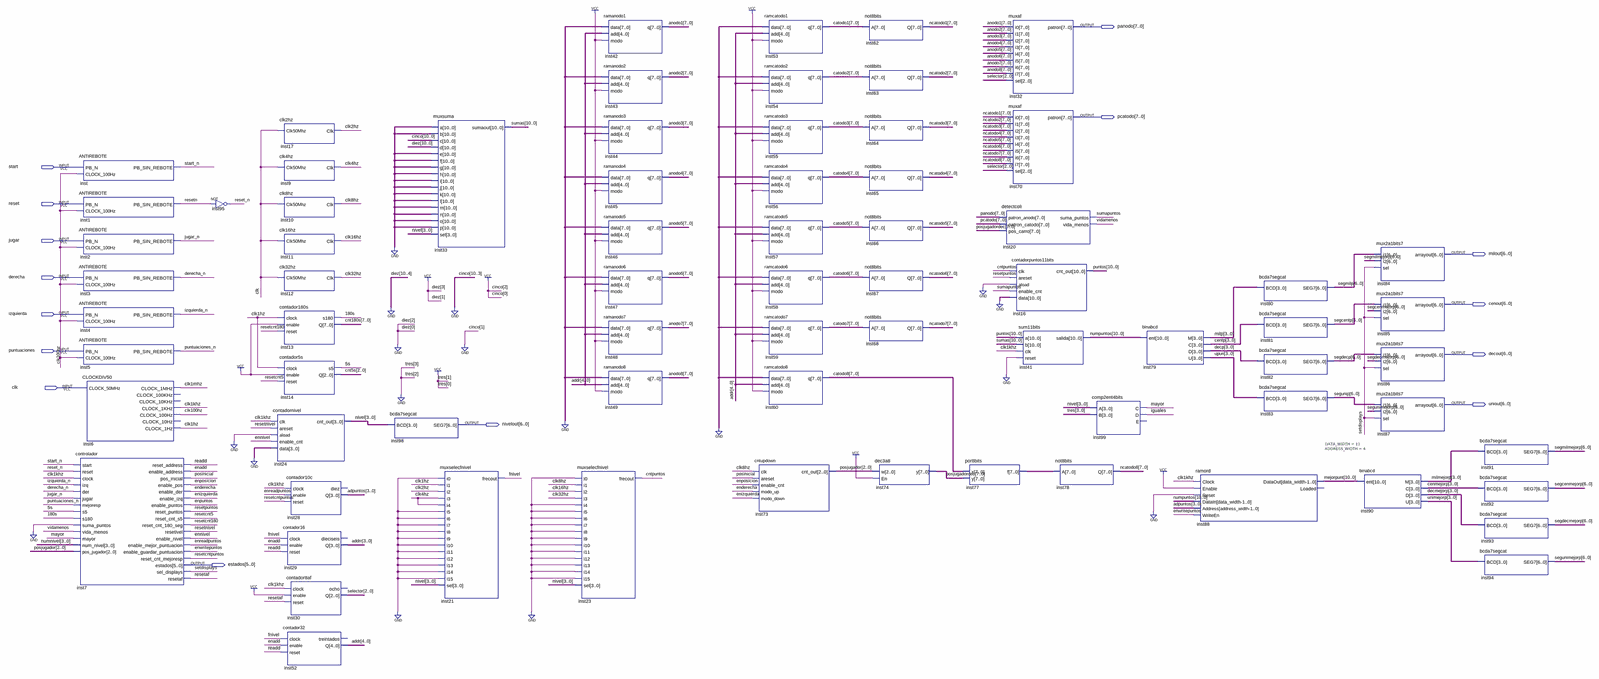
[diagram p0: schematic sheet, whole]
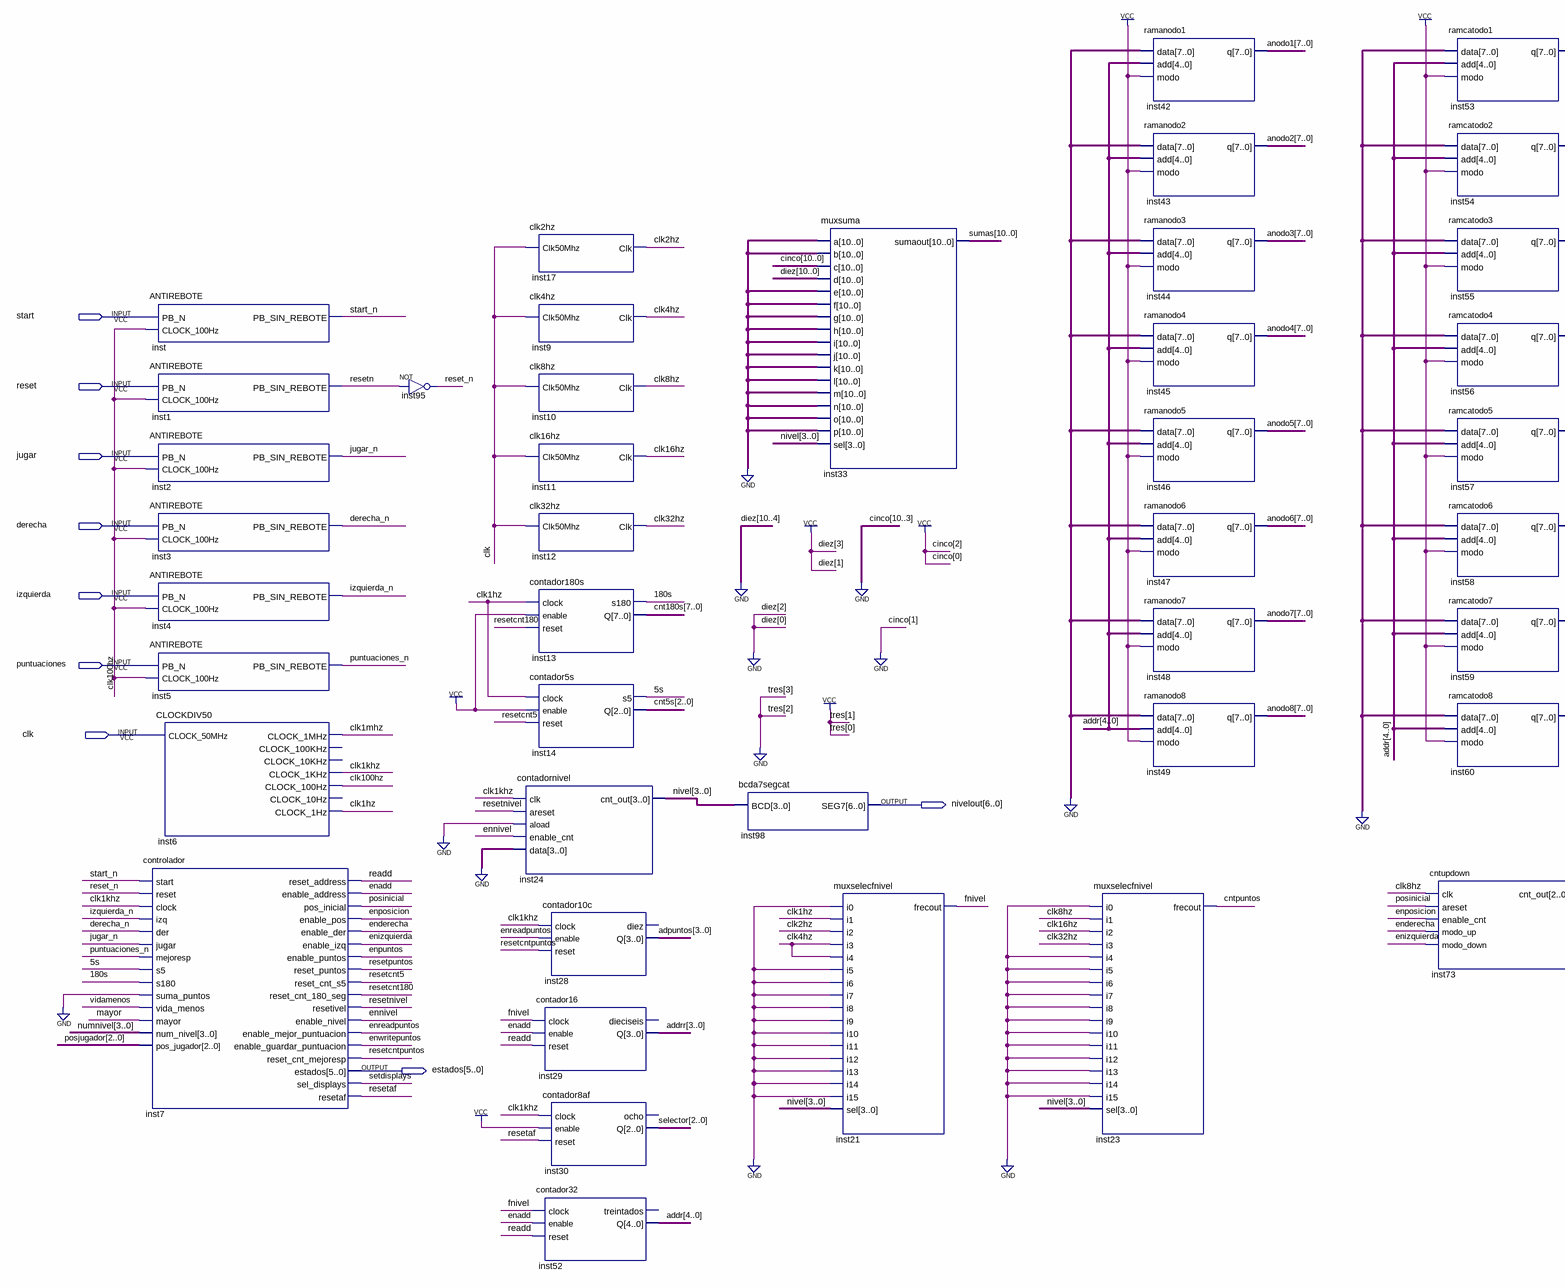
[diagram p1: schematic sheet, left part]
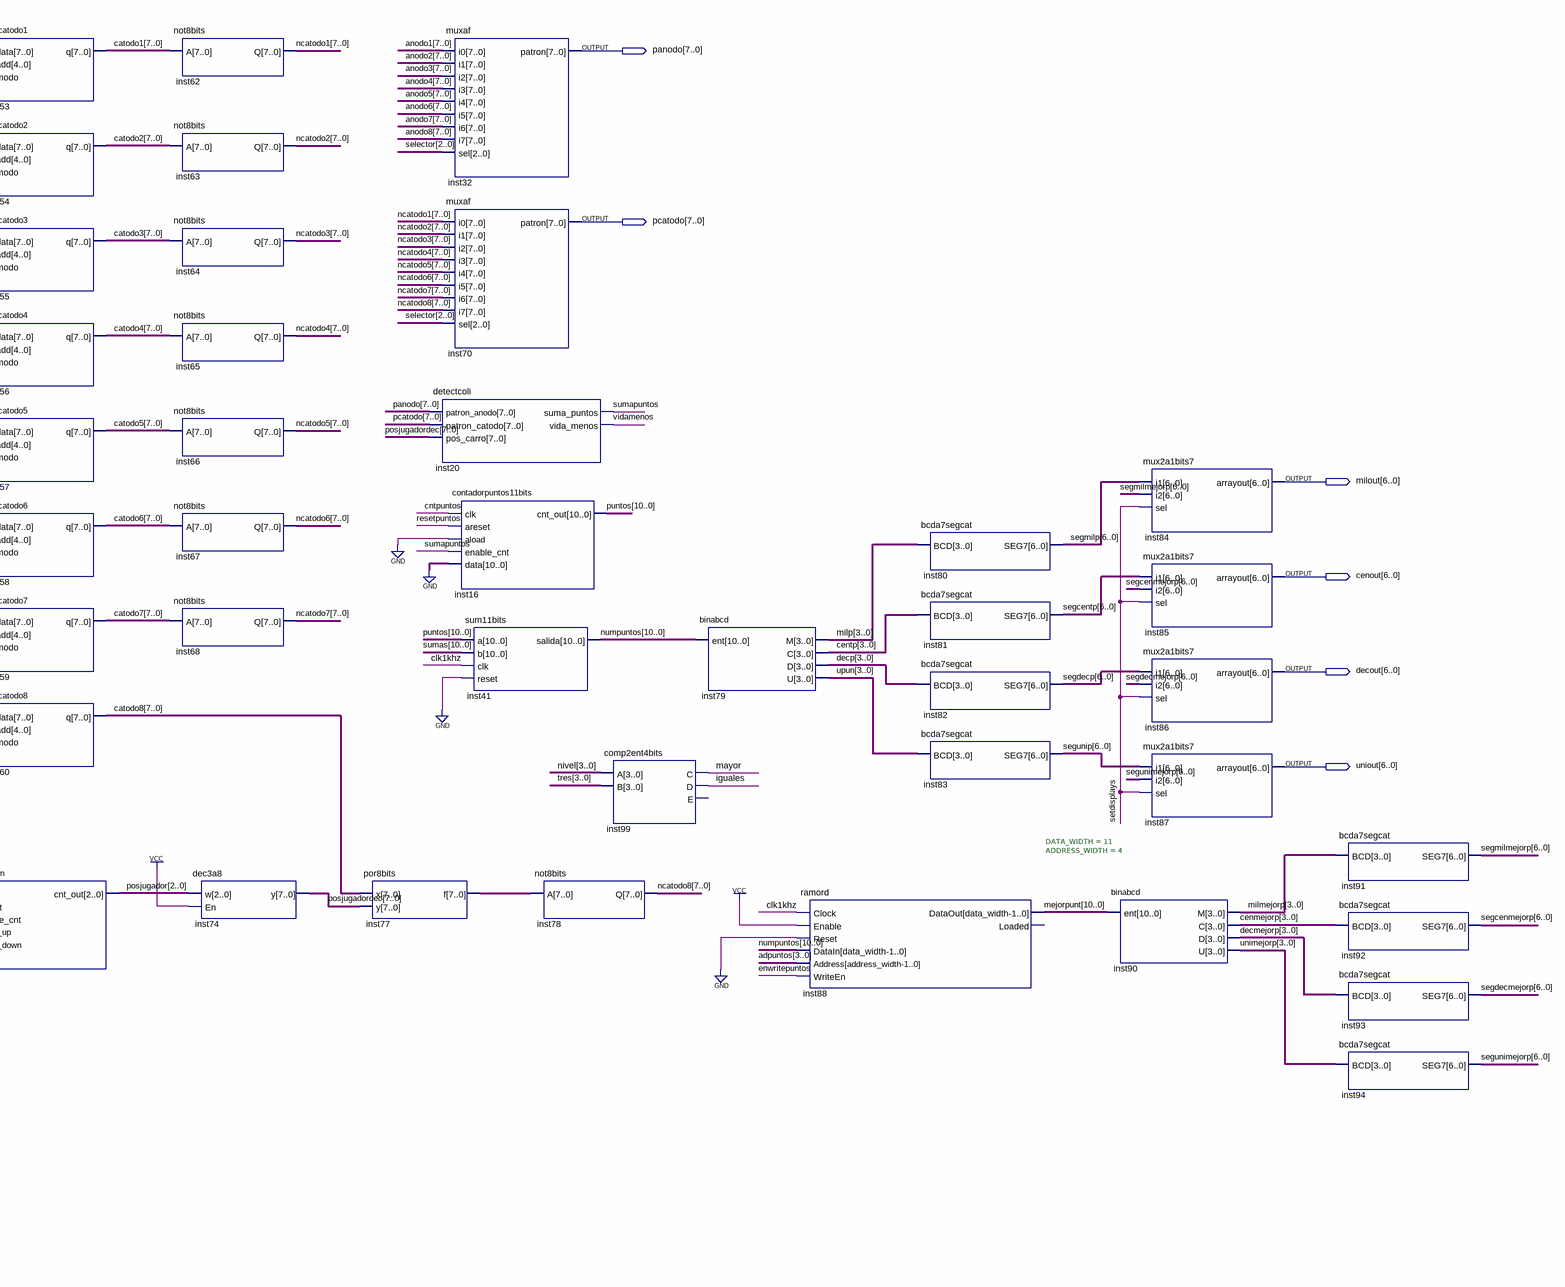
[diagram p2: schematic sheet, right part]
// Quartus schematic Proyecto.bdf as structural Verilog: 73 symbols, 15 pins
module Proyecto (
  input  start,
  input  reset,
  input  jugar,
  input  derecha,
  input  izquierda,
  input  puntuaciones,
  input  clk,
  output [7:0] panodo,
  output [7:0] pcatodo,
  output [6:0] milout,
  output [6:0] cenout,
  output [6:0] decout,
  output [6:0] uniout,
  output [6:0] nivelout,
  output [5:0] estados
);

  wire \5s , \180s , clk1hz, clk1khz, clk1mhz, clk2hz, clk4hz, clk8hz, clk16hz, clk32hz, clk100hz, cntpuntos,
       derecha_n, enadd, enderecha, enizquierda, ennivel, enposicion, enpuntos, enreadpuntos, enwritepuntos,
       fnivel, iguales, izquierda_n, jugar_n, mayor, posinicial, puntuaciones_n, readd, reset_n, resetaf,
       resetcnt5, resetcnt180, resetcntpuntos, resetn, resetnivel, resetpuntos, setdisplays, start_n,
       sumapuntos, vidamenos;
  wire [2:0] cnt5s, posjugador, selector;
  wire [3:0] addrr, adpuntos, cenmejorp, centp, decmejorp, decp, milmejorp, milp, nivel, numnivel, unimejorp,
       upun;
  wire [4:0] addr;
  wire [6:0] segcenmejorp, segcentp, segdecmejorp, segdecp, segmilmejorp, segmilp, segunimejorp, segunip;
  wire [7:0] anodo1, anodo2, anodo3, anodo4, anodo5, anodo6, anodo7, anodo8, catodo1, catodo2, catodo3,
       catodo4, catodo5, catodo6, catodo7, catodo8, cnt180s, inst77_f, ncatodo1, ncatodo2, ncatodo3,
       ncatodo4, ncatodo5, ncatodo6, ncatodo7, ncatodo8, posjugadordec;
  wire [10:0] mejorpunt, numpuntos, puntos, sumas;

  controlador inst7 (
    .start(start_n), .reset(reset_n), .clock(clk1khz), .izq(izquierda_n), .der(derecha_n), .jugar(jugar_n),
    .mejoresp(puntuaciones_n), .s5(\5s ), .s180(\180s ), .suma_puntos(1'b0), .vida_menos(vidamenos),
    .mayor(mayor), .num_nivel(numnivel), .pos_jugador(posjugador), .reset_address(readd),
    .enable_address(enadd), .pos_inicial(posinicial), .enable_pos(enposicion), .enable_der(enderecha),
    .enable_izq(enizquierda), .enable_puntos(enpuntos), .reset_puntos(resetpuntos), .reset_cnt_s5(resetcnt5),
    .reset_cnt_180_seg(resetcnt180), .resetivel(resetnivel), .enable_nivel(ennivel),
    .enable_mejor_puntuacion(enreadpuntos), .enable_guardar_puntuacion(enwritepuntos),
    .reset_cnt_mejoresp(resetcntpuntos), .estados(estados), .sel_displays(setdisplays), .resetaf(resetaf));
  ANTIREBOTE inst (.PB_N(start), .CLOCK_100Hz(clk100hz), .PB_SIN_REBOTE(start_n));
  ANTIREBOTE inst1 (.PB_N(reset), .CLOCK_100Hz(clk100hz), .PB_SIN_REBOTE(resetn));
  ANTIREBOTE inst2 (.PB_N(jugar), .CLOCK_100Hz(clk100hz), .PB_SIN_REBOTE(jugar_n));
  ANTIREBOTE inst3 (.PB_N(derecha), .CLOCK_100Hz(clk100hz), .PB_SIN_REBOTE(derecha_n));
  ANTIREBOTE inst4 (.PB_N(izquierda), .CLOCK_100Hz(clk100hz), .PB_SIN_REBOTE(izquierda_n));
  ANTIREBOTE inst5 (.PB_N(puntuaciones), .CLOCK_100Hz(clk100hz), .PB_SIN_REBOTE(puntuaciones_n));
  CLOCKDIV50 inst6 (
    .CLOCK_50MHz(clk), .CLOCK_1MHz(clk1mhz), .CLOCK_1KHz(clk1khz), .CLOCK_100Hz(clk100hz), .CLOCK_1Hz(clk1hz));  // open: CLOCK_100KHz, CLOCK_10KHz, CLOCK_10Hz
  not inst95 (reset_n, resetn);
  clk2hz inst17 (.Clk50Mhz(clk), .Clk(clk2hz));
  clk4hz inst9 (.Clk50Mhz(clk), .Clk(clk4hz));
  clk8hz inst10 (.Clk50Mhz(clk), .Clk(clk8hz));
  clk16hz inst11 (.Clk50Mhz(clk), .Clk(clk16hz));
  clk32hz inst12 (.Clk50Mhz(clk), .Clk(clk32hz));
  contador180s inst13 (.clock(clk1hz), .enable(1'b1), .reset(resetcnt180), .s180(\180s ), .Q(cnt180s));
  contador5s inst14 (.clock(clk1hz), .enable(1'b1), .reset(resetcnt5), .s5(\5s ), .Q(cnt5s));
  contadornivel inst24 (
    .clk(clk1khz), .areset(resetnivel), .aload(1'b0), .enable_cnt(ennivel), .data(4'b0000), .cnt_out(nivel));
  contador10c inst28 (.clock(clk1khz), .enable(enreadpuntos), .reset(resetcntpuntos), .Q(adpuntos));  // open: diez
  contador16 inst29 (.clock(fnivel), .enable(enadd), .reset(readd), .Q(addrr));  // open: dieciseis
  contador8af inst30 (.clock(clk1khz), .enable(1'b1), .reset(resetaf), .Q(selector));  // open: ocho
  contador32 inst52 (.clock(fnivel), .enable(enadd), .reset(readd), .Q(addr));  // open: treintados
  bcda7segcat inst98 (.BCD(nivel), .SEG7(nivelout));
  muxsuma inst33 (
    .a({11{1'b0}}), .b({11{1'b0}}), .c(11'b00000000101), .d(11'b00000001010), .e({11{1'b0}}), .f({11{1'b0}}),
    .g({11{1'b0}}), .h({11{1'b0}}), .i({11{1'b0}}), .j({11{1'b0}}), .k({11{1'b0}}), .l({11{1'b0}}),
    .m({11{1'b0}}), .n({11{1'b0}}), .o({11{1'b0}}), .p({11{1'b0}}), .sel(nivel), .sumaout(sumas));
  muxselecfnivel inst21 (
    .i0(1'b0), .i1(clk1hz), .i2(clk2hz), .i3(clk4hz), .i4(clk4hz), .i5(1'b0), .i6(1'b0), .i7(1'b0),
    .i8(1'b0), .i9(1'b0), .i10(1'b0), .i11(1'b0), .i12(1'b0), .i13(1'b0), .i14(1'b0), .i15(1'b0),
    .sel(nivel), .frecout(fnivel));
  muxselecfnivel inst23 (
    .i0(1'b0), .i1(clk8hz), .i2(clk16hz), .i3(clk32hz), .i4(1'b0), .i5(1'b0), .i6(1'b0), .i7(1'b0),
    .i8(1'b0), .i9(1'b0), .i10(1'b0), .i11(1'b0), .i12(1'b0), .i13(1'b0), .i14(1'b0), .i15(1'b0),
    .sel(nivel), .frecout(cntpuntos));
  ramanodo1 inst42 (.data({8{1'b0}}), .add(addr), .modo(1'b1), .q(anodo1));
  ramanodo2 inst43 (.data({8{1'b0}}), .add(addr), .modo(1'b1), .q(anodo2));
  ramanodo3 inst44 (.data({8{1'b0}}), .add(addr), .modo(1'b1), .q(anodo3));
  ramanodo4 inst45 (.data({8{1'b0}}), .add(addr), .modo(1'b1), .q(anodo4));
  ramanodo5 inst46 (.data({8{1'b0}}), .add(addr), .modo(1'b1), .q(anodo5));
  ramanodo6 inst47 (.data({8{1'b0}}), .add(addr), .modo(1'b1), .q(anodo6));
  ramanodo7 inst48 (.data({8{1'b0}}), .add(addr), .modo(1'b1), .q(anodo7));
  ramanodo8 inst49 (.data({8{1'b0}}), .add(addr), .modo(1'b1), .q(anodo8));
  ramcatodo1 inst53 (.data({8{1'b0}}), .add(addr), .modo(1'b1), .q(catodo1));
  ramcatodo2 inst54 (.data({8{1'b0}}), .add(addr), .modo(1'b1), .q(catodo2));
  ramcatodo3 inst55 (.data({8{1'b0}}), .add(addr), .modo(1'b1), .q(catodo3));
  ramcatodo4 inst56 (.data({8{1'b0}}), .add(addr), .modo(1'b1), .q(catodo4));
  ramcatodo5 inst57 (.data({8{1'b0}}), .add(addr), .modo(1'b1), .q(catodo5));
  ramcatodo6 inst58 (.data({8{1'b0}}), .add(addr), .modo(1'b1), .q(catodo6));
  ramcatodo7 inst59 (.data({8{1'b0}}), .add(addr), .modo(1'b1), .q(catodo7));
  ramcatodo8 inst60 (.data({8{1'b0}}), .add(addr), .modo(1'b1), .q(catodo8));
  cntupdown inst73 (
    .clk(clk8hz), .areset(posinicial), .enable_cnt(enposicion), .modo_up(enderecha), .modo_down(enizquierda),
    .cnt_out(posjugador));
  not8bits inst62 (.A(catodo1), .Q(ncatodo1));
  not8bits inst63 (.A(catodo2), .Q(ncatodo2));
  not8bits inst64 (.A(catodo3), .Q(ncatodo3));
  not8bits inst65 (.A(catodo4), .Q(ncatodo4));
  not8bits inst66 (.A(catodo5), .Q(ncatodo5));
  not8bits inst67 (.A(catodo6), .Q(ncatodo6));
  not8bits inst68 (.A(catodo7), .Q(ncatodo7));
  dec3a8 inst74 (.w(posjugador), .En(1'b1), .y(posjugadordec));
  por8bits inst77 (.x(catodo8), .y(posjugadordec), .f(inst77_f));
  muxaf inst32 (
    .i0(anodo1), .i1(anodo2), .i2(anodo3), .i3(anodo4), .i4(anodo5), .i5(anodo6), .i6(anodo7), .i7(anodo8),
    .sel(selector), .patron(panodo));
  muxaf inst70 (
    .i0(ncatodo1), .i1(ncatodo2), .i2(ncatodo3), .i3(ncatodo4), .i4(ncatodo5), .i5(ncatodo6), .i6(ncatodo7),
    .i7(ncatodo8), .sel(selector), .patron(pcatodo));
  detectcoli inst20 (
    .patron_anodo(panodo), .patron_catodo(pcatodo), .pos_carro(posjugadordec), .suma_puntos(sumapuntos),
    .vida_menos(vidamenos));
  contadorpuntos11bits inst16 (
    .clk(cntpuntos), .areset(resetpuntos), .aload(1'b0), .enable_cnt(sumapuntos), .data({11{1'b0}}),
    .cnt_out(puntos));
  sum11bits inst41 (.a(puntos), .b(sumas), .clk(clk1khz), .reset(1'b0), .salida(numpuntos));
  not8bits inst78 (.A(inst77_f), .Q(ncatodo8));
  comp2ent4bits inst99 (.A(nivel), .B(4'b0011), .C(mayor), .D(iguales));  // open: E
  binabcd inst79 (.ent(numpuntos), .M(milp), .C(centp), .D(decp), .U(upun));
  ramord #(.DATA_WIDTH(11), .ADDRESS_WIDTH(4)) inst88 (
    .Clock(clk1khz), .Enable(1'b1), .Reset(1'b0), .DataIn(numpuntos), .Address(adpuntos),
    .WriteEn(enwritepuntos), .DataOut(mejorpunt));  // open: Loaded
  bcda7segcat inst80 (.BCD(milp), .SEG7(segmilp));
  bcda7segcat inst81 (.BCD(centp), .SEG7(segcentp));
  bcda7segcat inst82 (.BCD(decp), .SEG7(segdecp));
  bcda7segcat inst83 (.BCD(upun), .SEG7(segunip));
  binabcd inst90 (.ent(mejorpunt), .M(milmejorp), .C(cenmejorp), .D(decmejorp), .U(unimejorp));
  mux2a1bits7 inst84 (.i1(segmilp), .i2(segmilmejorp), .sel(setdisplays), .arrayout(milout));
  mux2a1bits7 inst85 (.i1(segcentp), .i2(segcenmejorp), .sel(setdisplays), .arrayout(cenout));
  mux2a1bits7 inst86 (.i1(segdecp), .i2(segdecmejorp), .sel(setdisplays), .arrayout(decout));
  mux2a1bits7 inst87 (.i1(segunip), .i2(segunimejorp), .sel(setdisplays), .arrayout(uniout));
  bcda7segcat inst91 (.BCD(milmejorp), .SEG7(segmilmejorp));
  bcda7segcat inst92 (.BCD(cenmejorp), .SEG7(segcenmejorp));
  bcda7segcat inst93 (.BCD(decmejorp), .SEG7(segdecmejorp));
  bcda7segcat inst94 (.BCD(unimejorp), .SEG7(segunimejorp));
endmodule
